# EAGLE design switch_button (EAGLE 9.5.0)
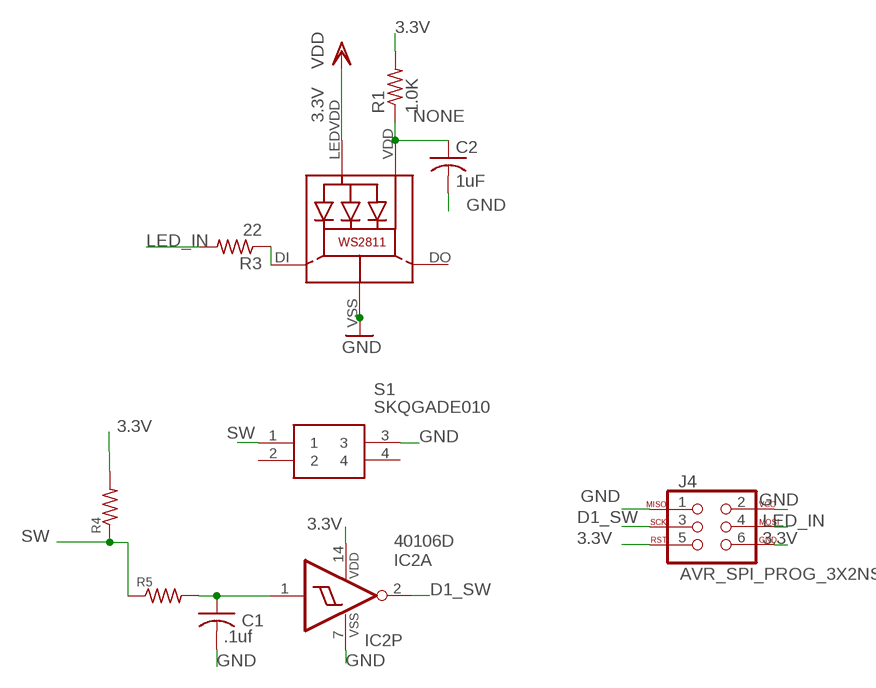
[diagram p0: schematic, sheet 1]

## Parts
C1  .1uf  ADAFRUIT_C-USC1206K  [ADAFRUIT_C1206K]
C2  1uF  C-USC1206K  [C1206K]
IC2  40106D  [SO14]
J4  AVR_SPI_PROG_3X2NS  [2X3-NS]
LED1  WS28115050  [WS28115050]
R1  1.0K  RES-US1206FAB  [R1206FAB]
R3  22  R-US_M1206  [M1206]
R4  10k  R-US_M1206  [M1206]
R5  10k  R-US_M1206  [M1206]
S1  SKQGADE010  [SKQGAKE010]

## Nets
3.3V: IC2.14(P:VDD) J4.5 J4.6 LED1.LEDVDD R1.2 R4.2 ; supply symbol labelled VDD
D1_SW: IC2.2(A:O) J4.3
GND: C1.2 C2.2 IC2.7(P:VSS) J4.1 J4.2 LED1.VSS(GND) S1.3
LED_IN: J4.4 R3.2
N$2: LED1.DI R3.1
N$5: C1.1 IC2.1(A:I) R5.2
NONE: C2.1 LED1.VDD R1.1
SW: R4.1 R5.1 S1.1
Unconnected: IC2.3(B:I) IC2.4(B:O) IC2.5(C:I) IC2.6(C:O) IC2.8(D:O) IC2.9(D:I) IC2.10(E:O) IC2.11(E:I) IC2.12(F:O) IC2.13(F:I) LED1.DO S1.2 S1.4

## Library data of the parts
C1 = Adafruit ADXL335.rpt:ADAFRUIT_C-US: CAPACITOR, American symbol
C2 = adafruit:C-US: CAPACITOR, American symbol
IC2 = 40xx:40106: Hex SCHMITT TRIGGER
J4 = SparkFun-Connectors:AVR_SPI_PROG_3X2: AVR ISP 6 Pin This is the reduced ISP connector for AVR programming. Common on Arduino. This footprint will take up less PCB space and can be used with a 10-pin to 6-pin adapter such as SKU: BOB-08508 **Special note about "TEST_POINT" package. The stop mask is on the top side, so if you want your programming test points to be on the bottom of your board, make sure to place this package on the bottom side of the board. This also ensure that the orientation to program from the bottom side will be correct. SparkFun Products: SparkFun ISP Pogo Adapter <https://www.sparkfun.com/products/11591> - NS Tiny AVR Programmer <https://www.sparkfun.com/products/11801> -PTH
LED1 = microbuilder:WS28115050
R1 = fab:RES-US: Resistor (US Symbol) Variants with postfix FAB are widened to allow the routing of internal traces
R3-R5 = adafruit:R-US_: RESISTOR, American symbol
S1 = SamacSys_Parts:SKQGADE010: Tact switch,SMT,SPST,with stem,2.55N o/f Stem Tactile Switch, SPST-NO 50 mA 1.5mm Source: Datasheet <http://www.farnell.com/datasheets/1776657.pdf>; DESCRIPTION: Tact switch,SMT,SPST,with stem,2.55N o/f Stem Tactile Switch, SPST-NO 50 mA 1.5mm; HEIGHT: mm; MANUFACTURER_NAME: ALPS; MANUFACTURER_PART_NUMBER: SKQGADE010; MOUSER_PART_NUMBER: 688-SKQGAD; MOUSER_PRICE-STOCK: https://www.mouser.com/Search/Refine.aspx?Keyword=688-SKQGAD; RS_PART_NUMBER: 7582067; RS_PRICE-STOCK: http://uk.rs-online.com/web/p/products/7582067

## Board
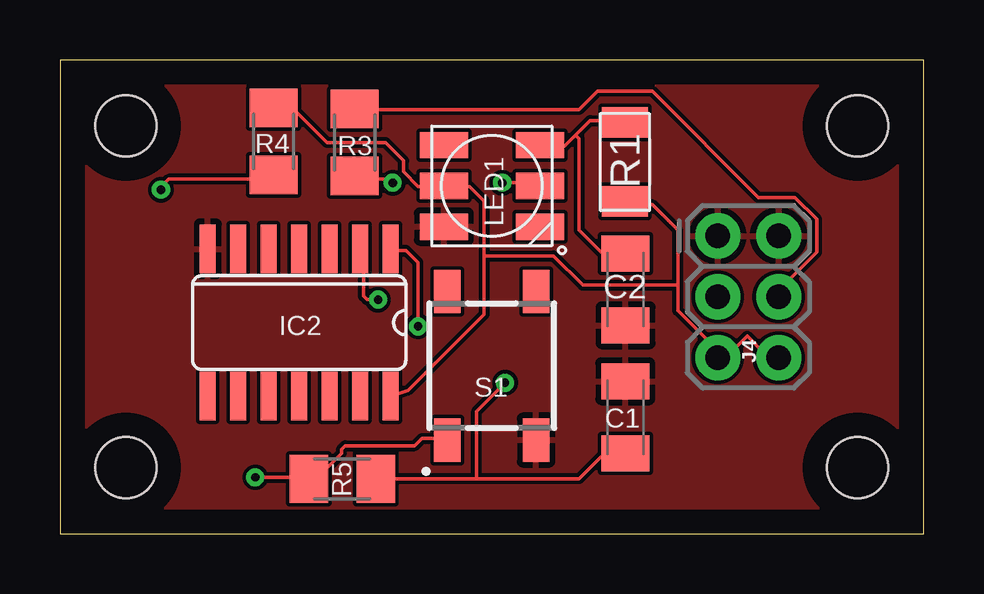
[diagram p1: board, top side]
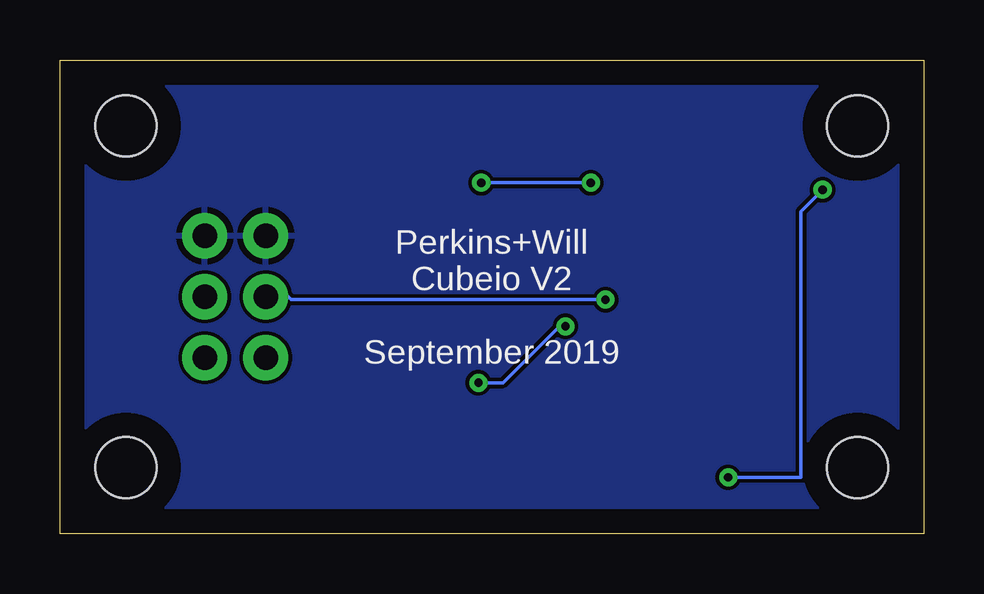
[diagram p2: board, bottom side, seen from below]

Size 36 x 19.75 mm. Coordinates in mm from the lower left corner, seen from the top.
Outline: 0,0 36,0 36,19.75 0,19.75 0,0
Copper layers (1*16): Top 0.035mm / dielectric 1.5mm / Bottom 0.035mm
Design rules "default": minimum track width 6mil, minimum drill 0.35mm, track to track 6mil, track to pad 6mil, pad to pad 6mil, via to via 6mil, smd to smd 6mil, copper to edge 40mil, drill to drill 6mil, minimum pad ring 10mil, minimum via ring 8mil, stop-mask expansion 4mil, vias tented up to drill 0mil, thermal gap 10mil
Holes 2.54 mm at 2.75,17 2.75,2.75 33.25,2.75 33.25,17

### Footprints (pad centres in the part's own frame; a part is rotated, then mirrored left to right if it is on the bottom)
ADAFRUIT_C1206K = smd 1.5 x 2: 1 -1.5,0; 2 1.5,0
C1206K = smd 1.5 x 2: 1 -1.5,0; 2 1.5,0
SO14 = smd 0.66 x 2.032: 1 -3.81,-3.073; 2 -2.54,-3.073; 3 -1.27,-3.073; 4 0,-3.073; 5 1.27,-3.073; 6 2.54,-3.073; 7 3.81,-3.073; 8 3.81,3.073; 9 2.54,3.073; 10 1.27,3.073; 11 0,3.073; 12 -1.27,3.073; 13 -2.54,3.073; 14 -3.81,3.073
2X3-NS = drill 1.016 pad 1.88: 1 -2.54,-1.27; 2 -2.54,1.27; 3 0,-1.27; 4 0,1.27; 5 2.54,-1.27; 6 2.54,1.27
WS28115050 = smd 2 x 1.1: DI 2,0; DO 2,-1.7; LEDVDD -2,0; NC -2,1.7; VDD 2,1.7; VSS -2,-1.7
R1206FAB = smd 1.27 x 1.905: 1 -1.651,0; 2 1.651,0
M1206 = smd 1.6 x 2: 1 -1.4,0; 2 1.4,0
SKQGAKE010 = smd 1.8 x 1.1: 1 -3.1,1.85; 2 3.1,1.85; 3 -3.1,-1.85; 4 3.1,-1.85

### Placement (x,y rotation side)
C1  23.57,4.85 90 top
C2  23.57,10.18 270 top
IC2  9.97,8.8 180 top
J4  28.69,9.88 270 top
LED1  18,14.5 0 top
R1  23.56,15.5 270 top
R3  12.29,16.31 90 top
R4  8.91,16.35 90 top
R5  11.77,2.28 0 top
S1  18,7 90 top

### Tracks (layer width: path | path; a pad name or v marks a point on that pad's centre or on a via)
3.3V
  Top 0.152: 25.76,10.36 25.76,9.3 27.28,7.77 27.28,7.47 J4.5 27.43,7.47 27.89,7.47 28.65,8.23 29.41,7.47 29.87,7.47 J4.6 | 25.76,10.36 25.76,12.65 24.69,13.72 23.62,13.72 R1.2 | R4.2 8.99,17.68 9.75,17.68 11.12,16.31 13.56,16.31 14.33,15.54 14.33,15.09 14.94,14.48 15.85,14.48 LED1.LEDVDD 16,14.48 17.07,14.48 17.68,13.87 17.68,11.58 | 17.68,11.58 17.68,9.14 14.51,5.97 IC2.14 | 25.76,10.36 21.79,10.36 20.57,11.58 17.68,11.58
D1_SW  (via drill 0.35)
  Top 0.152: v13.26,9.75 12.8,9.75 12.65,9.91 12.65,11.75 IC2.2
  Bottom 0.152: v13.26,9.75 26.36,9.75 26.52,9.91 27.28,9.91 J4.3
GND
  pour Top: 0.1,0.05 0.1,19.38 35.65,19.38 35.65,0.05
  pour Bottom: 0.25,0.2 0.25,19.38 35.55,19.38 35.55,0.22 0.28,0.22
LED_IN
  Top 0.152: R3.2 12.34,17.68 21.64,17.68 22.4,18.44 24.69,18.44 29.11,14.02 30.63,14.02 31.55,13.11 31.55,11.73 30.02,10.21 30.02,9.91 J4.4
N$2  (via drill 0.35)
  Top 0.152: v13.87,14.63 13.72,14.78 12.34,14.78 R3.1 | v18.44,14.63 19.96,14.63 LED1.DI
  Bottom 0.152: v18.44,14.63 v13.87,14.63
N$5  (via drill 0.35)
  Top 0.152: 17.37,2.29 21.64,2.29 22.55,3.2 23.47,3.2 C1.1 | 17.37,2.29 13.26,2.29 R5.2 | IC2.1 13.81,11.81 14.42,11.81 14.93,11.3 v14.93,8.64 | v18.55,6.28 17.37,5.1 17.37,2.29
  Bottom 0.152: v18.55,6.28 17.54,6.28 15.05,8.77 v14.93,8.64
NONE
  Top 0.152: 21.49,16.61 21.03,16.15 20.12,16.15 LED1.VDD | 21.49,16.61 22.1,17.22 23.47,17.22 R1.1 | 21.49,16.61 21.64,16.46 21.64,12.65 22.55,11.73 23.47,11.73 C2.1
SW  (via drill 0.35)
  Top 0.152: S1.1 16,3.96 15.09,3.96 14.78,3.66 11.89,3.66 11.73,3.5 11.73,3.35 10.57,2.19 10.47,2.29 R5.1 | R4.1 8.74,14.78 4.54,14.78 4.21,14.45 v4.21,14.34 | v8.14,2.34 10.41,2.34 | 10.41,2.34 10.46,2.29 10.45,2.29 R5.1 | R5.1 10.41,2.33 10.41,2.34
  Bottom 0.152: v4.21,14.34 5.11,13.44 5.11,2.34 v8.14,2.34

### Text on the board
bNames: Perkins+Will / Cubeio V2 / / September 2019